# EAGLE design smpsRev8 (EAGLE 9.6.2)
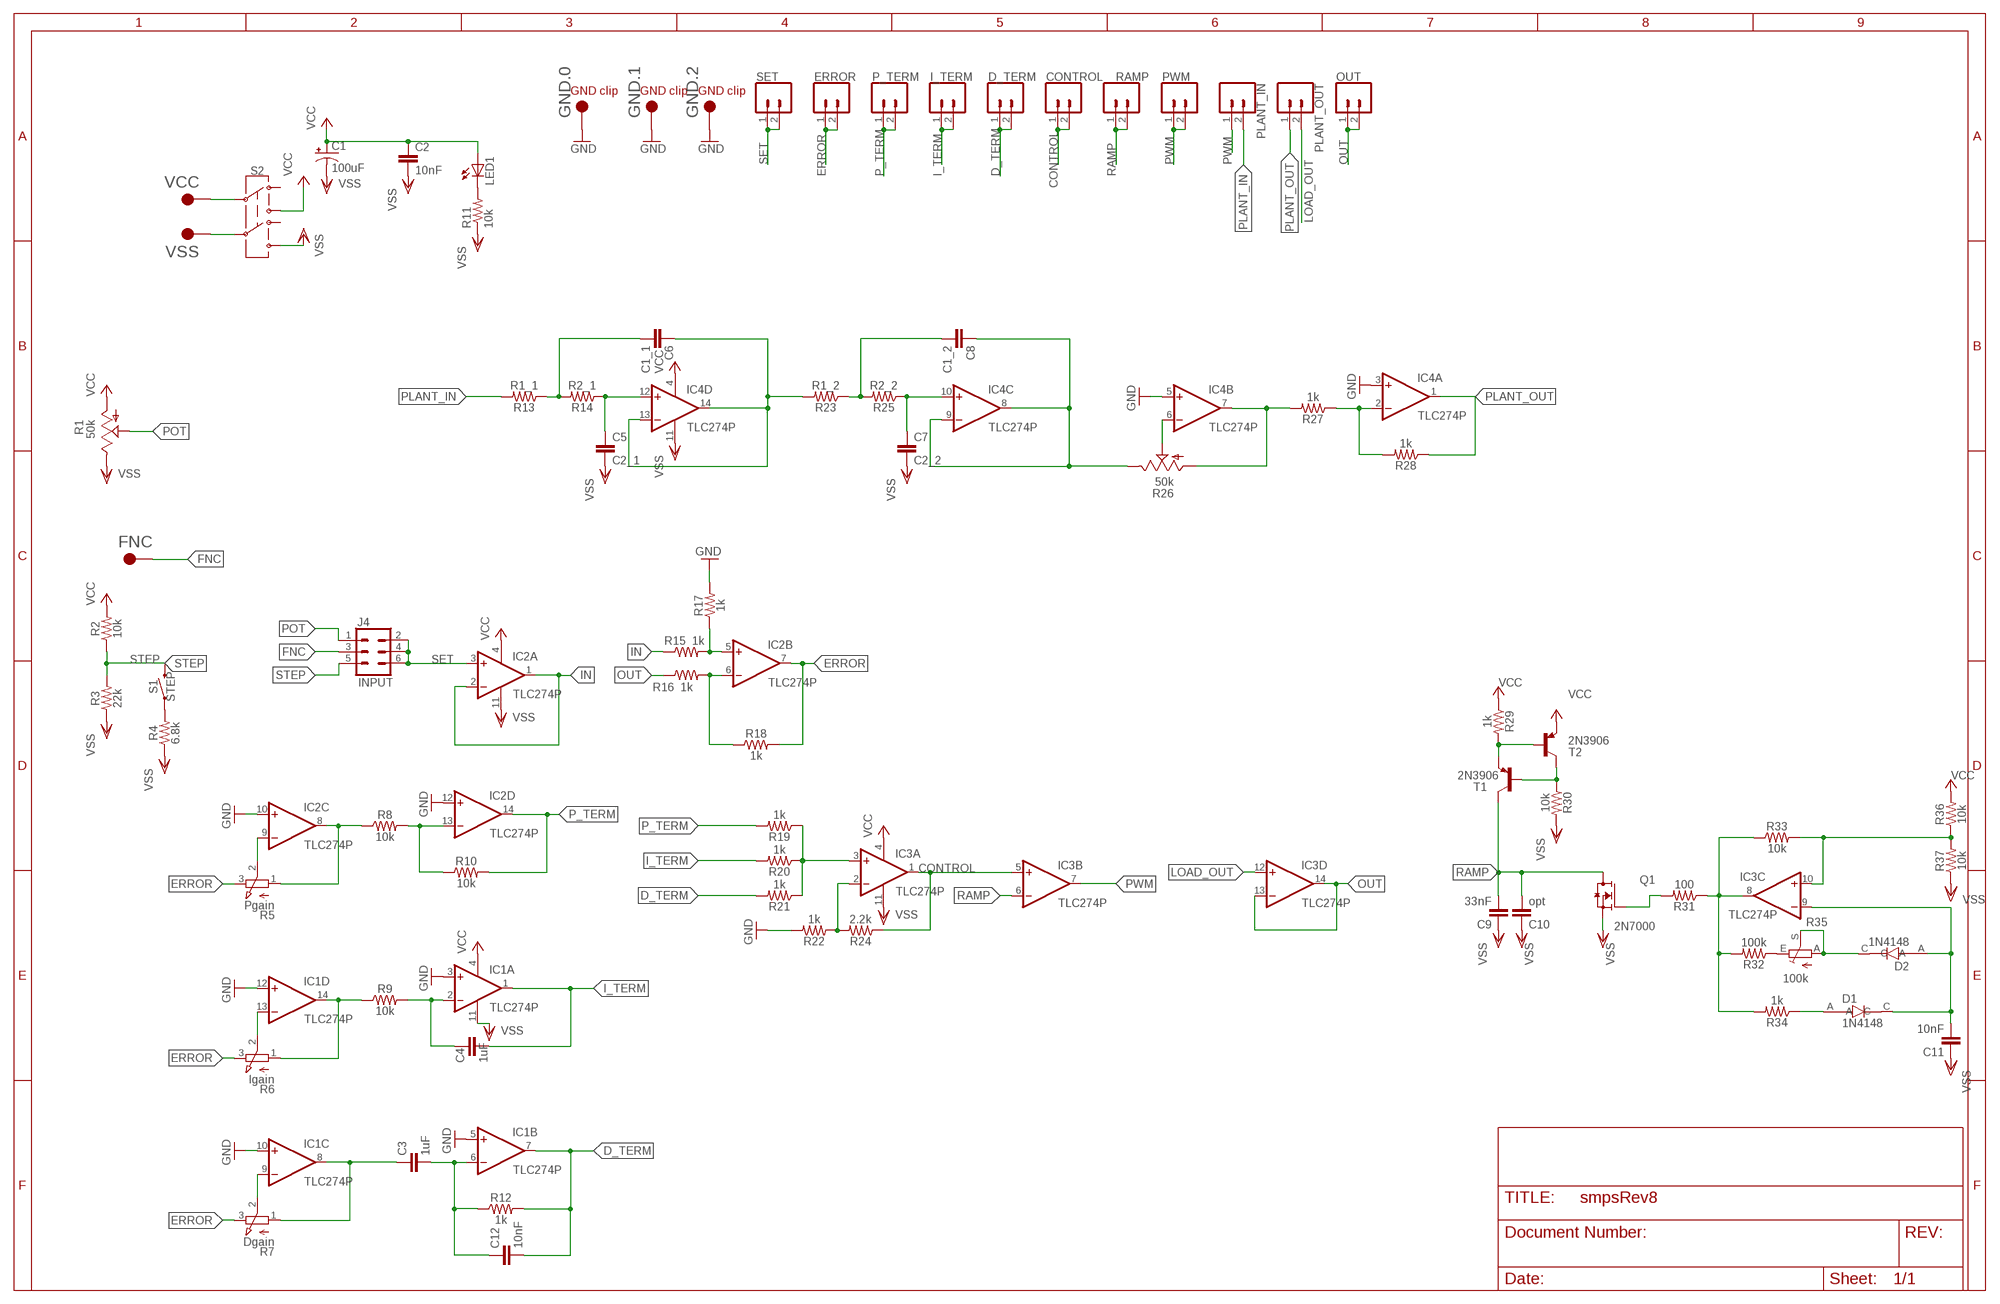
[diagram p0: schematic, sheet 1]

## Parts
C1  100uF  CPOL-USSANYO_C  [SANYO-OSCON_C]
C2  10nF  C-EUC1206  [C1206]
C3  1uF  C-EUC1206  [C1206]
C4  1uF  C-EUC1206  [C1206]
C5  C2_1  C-EUC1206  [C1206]
C6  C1_1  C-EUC1206  [C1206]
C7  C2_2  C-EUC1206  [C1206]
C8  C1_2  C-EUC1206  [C1206]
C9  33nF  C-EUC1206  [C1206]
C10  opt  C-EU050-024X044  [C050-024X044]
C11  10nF  C-EUC1206  [C1206]
C12  10nF  C-EUC1206  [C1206]
CONTROL  CONN_02LOCK  [1X02_LOCK]
D1  1N4148  1N4148WS-7-F  [SOD2513X120N]
D2  1N4148  1N4148WS-7-F  [SOD2513X120N]
D_TERM  CONN_02LOCK  [1X02_LOCK]
ERROR  CONN_02LOCK  [1X02_LOCK]
FNC  5016  [KEYSTONE_5016]
GND.0  5016  [KEYSTONE_5016]
GND.1  5016  [KEYSTONE_5016]
GND.2  5016  [KEYSTONE_5016]
I_TERM  CONN_02LOCK  [1X02_LOCK]
IC1  TLC274P  [DIL14]
IC2  TLC274P  [DIL14]
IC3  TLC274P  [DIL14]
IC4  TLC274P  [DIL14]
J4  INPUT  CONN_03X2FEMALE  [2X3]
LED1  LEDCHIPLED_1206  [CHIPLED_1206]
OUT  CONN_02LOCK  [1X02_LOCK]
P_TERM  CONN_02LOCK  [1X02_LOCK]
PLANT_IN  CONN_02LOCK  [1X02_LOCK]
PLANT_OUT  CONN_02LOCK  [1X02_LOCK]
PWM  CONN_02LOCK  [1X02_LOCK]
Q1  2N7000  [TO92254P458H750-3]
R1  50k  TRIM_US-B25P  [B25P]
R2  10k  RESISTOR1206  [1206]
R3  22k  RESISTOR1206  [1206]
R4  6.8k  RESISTOR1206  [1206]
R5  Pgain  EVUF2A  [EVUF]
R6  Igain  EVUF2A  [EVUF]
R7  Dgain  EVUF2A  [EVUF]
R8  10k  RESISTOR1206  [1206]
R9  10k  RESISTOR1206  [1206]
R10  10k  RESISTOR1206  [1206]
R11  10k  R-US_R1206  [R1206]
R12  1k  RESISTOR1206  [1206]
R13  R1_1  RESISTOR1206  [1206]
R14  R2_1  RESISTOR1206  [1206]
R15  1k  RESISTOR1206  [1206]
R16  1k  RESISTOR1206  [1206]
R17  1k  RESISTOR1206  [1206]
R18  1k  RESISTOR1206  [1206]
R19  1k  RESISTOR1206  [1206]
R20  1k  RESISTOR1206  [1206]
R21  1k  RESISTOR1206  [1206]
R22  1k  RESISTOR1206  [1206]
R23  R1_2  RESISTOR1206  [1206]
R24  2.2k  RESISTOR1206  [1206]
R25  R2_2  RESISTOR1206  [1206]
R26  50k  TRIM_US-B25P  [B25P]
R27  1k  RESISTOR1206  [1206]
R28  1k  RESISTOR1206  [1206]
R29  1k  RESISTOR1206  [1206]
R30  10k  RESISTOR1206  [1206]
R31  100  RESISTOR1206  [1206]
R32  100k  RESISTOR1206  [1206]
R33  10k  RESISTOR1206  [1206]
R34  1k  RESISTOR1206  [1206]
R35  100k  TRIM_EU-S64W  [S64W]
R36  10k  RESISTOR1206  [1206]
R37  10k  RESISTOR1206  [1206]
RAMP  CONN_02LOCK  [1X02_LOCK]
S1  STEP  MOMENTARY-SWITCH-SPST-SMD-5.2MM  [TACTILE_SWITCH_SMD_5.2MM]
S2  SWITCH-DPDT-SMD-AYZ0202  [SWITCH_DPDT_SMD_AYZ0202]
SET  CONN_02LOCK  [1X02_LOCK]
T1  2N3906  2N3906-PNP-TO92-EBC  [TO92-EBC]
T2  2N3906  2N3906-PNP-TO92-EBC  [TO92-EBC]
VCC  5016  [KEYSTONE_5016]
VSS  5016  [KEYSTONE_5016]

## Nets
CONTROL: CONTROL.1 CONTROL.2 IC3.1(A:OUT) IC3.5(B:+IN) R24.1
D_TERM: C12.2 D_TERM.1 D_TERM.2 IC1.7(B:OUT) R12.2 R21.2
ERROR: ERROR.1 ERROR.2 IC2.7(B:OUT) R5.3(E) R6.3(E) R7.3(E) R18.2
FNC: FNC.TP J4.3
GND: GND.0.TP GND.1.TP GND.2.TP IC1.3(A:+IN) IC1.5(B:+IN) IC1.10(C:+IN) IC1.12(D:+IN) IC2.10(C:+IN) IC2.12(D:+IN) IC4.3(A:+IN) IC4.5(B:+IN) R17.2 R22.2
I_TERM: C4.2 I_TERM.1 I_TERM.2 IC1.1(A:OUT) R20.2
IN: IC2.1(A:OUT) IC2.2(A:-IN) R15.1
LOAD_OUT: IC3.12(D:+IN) PLANT_OUT.2
N$1: IC2.5(B:+IN) R15.2 R17.1
N$2: IC2.6(B:-IN) R16.2 R18.1
N$3: IC4.7(B:OUT) R26.A R27.2
N$4: C4.1 IC1.2(A:-IN) R9.2
N$5: IC2.8(C:OUT) R5.1(A) R8.1
N$6: IC3.3(A:+IN) R19.1 R20.1 R21.1
N$7: IC3.2(A:-IN) R22.1 R24.2
N$8: S2.5 VSS.TP
N$9: IC3.10(C:+IN) R33.2 R36.1 R37.2
N$10: IC4.2(A:-IN) R27.1 R28.2
N$11: IC3.8(C:OUT) R31.1 R32.2 R33.1 R34.2
N$12: R29.2 T1.E T2.B
N$13: R30.1 T1.B T2.C
N$14: IC1.14(D:OUT) R6.1(A) R9.1
N$15: S2.2 VCC.TP
N$16: LED1.C R11.2
N$17: C3.1 IC1.8(C:OUT) R7.1(A)
N$18: IC1.13(D:-IN) R6.2(S)
N$19: IC2.13(D:-IN) R8.2 R10.1
N$20: R32.1 R35.E
N$21: IC1.9(C:-IN) R7.2(S)
N$22: C3.2 C12.1 IC1.6(B:-IN) R12.1
N$23: IC2.9(C:-IN) R5.2(S)
N$24: R4.2 S1.1
N$25: C6.2 R13.1 R14.2
N$26: C5.1 IC4.12(D:+IN) R14.1
N$27: C6.1 IC4.13(D:-IN) IC4.14(D:OUT) R23.2
N$28: D1.A R34.1
N$29: C8.2 R23.1 R25.2
N$30: C7.1 IC4.10(C:+IN) R25.1
N$31: C8.1 IC4.8(C:OUT) IC4.9(C:-IN) R26.E
N$32: C11.2 D1.C D2.A IC3.9(C:-IN)
N$33: IC4.6(B:-IN) R26.S
N$34: Q1.2(G) R31.2
N$35: D2.C R35.A R35.S
OUT: IC3.13(D:-IN) IC3.14(D:OUT) OUT.1 OUT.2 R16.1
P_TERM: IC2.14(D:OUT) P_TERM.1 P_TERM.2 R10.2 R19.2
PLANT_IN: PLANT_IN.2 R13.2
PLANT_OUT: IC4.1(A:OUT) PLANT_OUT.1 R28.1
POT: J4.1 R1.S
PWM: IC3.7(B:OUT) PLANT_IN.1 PWM.1 PWM.2
RAMP: C9.2 C10.2 IC3.6(B:-IN) Q1.3(D) RAMP.1 RAMP.2 T1.C
SET: IC2.3(A:+IN) J4.2 J4.4 J4.6 SET.1 SET.2
STEP: J4.5 R2.1 R3.2 S1.3
VCC: C1.+ C2.1 IC1.4(P:V+) IC2.4(P:V+) IC3.4(P:V+) IC4.4(P:V+) LED1.A R1.A R2.2 R29.1 R36.2 S2.3 T2.E
VSS: C1.- C2.2 C5.2 C7.2 C9.1 C10.1 C11.1 IC1.11(P:V-) IC2.11(P:V-) IC3.11(P:V-) IC4.11(P:V-) Q1.1(S) R1.E R3.1 R4.1 R11.1 R30.2 R37.1 S2.6
Unconnected: S2.1 S2.4

## Notes on the sheet
- GND clip | GND clip | GND clip

## Library data of the parts
C1 = rcl:CPOL-US: POLARIZED CAPACITOR, American symbol; SPICEPREFIX: C
C2-C12 = rcl:C-EU: CAPACITOR, European symbol; SPICEPREFIX: C
CONTROL D_TERM ERROR I_TERM OUT P_TERM PLANT_IN PLANT_OUT PWM RAMP SET = SparkFun-Connectors:CONN_02: Multi connection point. Often used as Generic Header-pin footprint for 0.1 inch spaced/style header connections On any of the 0.1 inch spaced packages, you can populate with these: Break Away Headers - Straight <https://www.sparkfun.com/products/116> (PRT-00116) Break Away Male Headers - Right Angle <https://www.sparkfun.com/products/553> (PRT-00553) Female Headers <https://www.sparkfun.com/products/115> (PRT-00115) Break Away Headers - Machine Pin <https://www.sparkfun.com/products/117> (PRT-00117) Break Away Female Headers - Swiss Machine Pin <https://www.sparkfun.com/products/743> (PRT-00743) For SCREWTERMINALS and SPRING TERMINALS visit here: Screw Terimnals on SparkFun.com <https://www.sparkfun.com/search/results?term=Screw+Terminals> (5mm/3.5mm/2.54mm spacing) This device is also useful as a general connection point to wire up your design to another part of your project. Our various solder wires solder well into these plated through hole pads. Hook-Up Wire - Assortment (Stranded, 22 AWG) <https://www.sparkfun.com/products/11375> (PRT-11375) Hook-Up Wire - Assortment (Solid Core, 22 AWG) <https://www.sparkfun.com/products/11367> (PRT-11367) View the entire wire category on our website here <https://www.sparkfun.com/categories/141> Special notes: Molex polarized connector foot print use with: PRT-08233 with associated crimp pins and housings. 2.54_SCREWTERM for use with PRT-10571. 3.5mm Screw Terminal footprints for PRT-08084 5mm Screw Terminal footprints for use with PRT-08432
D1 D2 = 1N4148WS-7-F:1N4148WS-7-F; MANUFACTURER: Diodes Inc.
FNC GND.0 GND.1 GND.2 VCC VSS = 5016:5016; MANUFACTURER: Keystone Electronics; MAXIMUM_PACKAGE_HEIGHT: 2.29 mm; PARTREV: D; SNAPEDA_PN: 5016; STANDARD: Manufacturer Recommendations
IC1-IC4 = linear:TLC274: OP AMP
J4 = SparkFun-Connectors:CONN_03X2: Multi connection point. Often used as Generic Header-pin footprint for 0.1 inch spaced/style header connections You can populate with any combo of single row headers, but if you'd like an exact match, check these: Header - 2x3 (Male, 0.1") <https://www.sparkfun.com/products/12807> (PRT-12807) Header - 2x3 (Female, 0.1") <https://www.sparkfun.com/products/13010> (PRT-13010) 2x3 Pin Shrouded Header <https://www.sparkfun.com/products/10877> (PRT-10877) On any of the 0.1 inch spaced packages, you can populate with these: Break Away Headers - Straight <https://www.sparkfun.com/products/116> (PRT-00116) Break Away Male Headers - Right Angle <https://www.sparkfun.com/products/553> (PRT-00553) Female Headers <https://www.sparkfun.com/products/115> (PRT-00115) Break Away Headers - Machine Pin <https://www.sparkfun.com/products/117> (PRT-00117) Break Away Female Headers - Swiss Machine Pin <https://www.sparkfun.com/products/743> (PRT-00743) Special note: the shrouded connector mates well with our 3x2 ribbon cables: Ribbon Crimp Connector - 6-pin (2x3, Female) <https://www.sparkfun.com/products/10651> (PRT-10651) Ribbon Cable - 6 wire (15ft) <https://www.sparkfun.com/products/10646> (PRT-10646); PROD_ID: CONN-11566; VALUE: FEMALE 2x3
LED1 = led:LED: LED OSRAM: - CHIPLED LG R971, LG N971, LY N971, LG Q971, LY Q971, LO R971, LY R971 LH N974, LH R974 LS Q976, LO Q976, LY Q976 LO Q996 - Hyper CHIPLED LW Q18S LB Q993, LB Q99A, LB R99A - SideLED LS A670, LO A670, LY A670, LG A670, LP A670 LB A673, LV A673, LT A673, LW A673 LH A674 LY A675 LS A676, LA A676, LO A676, LY A676, LW A676 LS A679, LY A679, LG A679 - Hyper Micro SIDELED® LS Y876, LA Y876, LO Y876, LY Y876 LT Y87S - SmartLED LW L88C, LW L88S LB L89C, LB L89S, LG L890 LS L89K, LO L89K, LY L89K LS L896, LA L896, LO L896, LY L896 - TOPLED LS T670, LO T670, LY T670, LG T670, LP T670 LSG T670, LSP T670, LSY T670, LOP T670, LYG T670 LG T671, LOG T671, LSG T671 LB T673, LV T673, LT T673, LW T673 LH T674 LS T676, LA T676, LO T676, LY T676, LB T676, LH T676, LSB T676, LW T676 LB T67C, LV T67C, LT T67C, LS T67K, LO T67K, LY T67K, LW E67C LS E67B, LA E67B, LO E67B, LY E67B, LB E67C, LV E67C, LT E67C LW T67C LS T679, LY T679, LG T679 LS T770, LO T770, LY T770, LG T770, LP T770 LB T773, LV T773, LT T773, LW T773 LH T774 LS E675, LA E675, LY E675, LS T675 LS T776, LA T776, LO T776, LY T776, LB T776 LHGB T686 LT T68C, LB T68C - Hyper Mini TOPLED® LB M676 - Mini TOPLED Santana® LG M470 LS M47K, LO M47K, LY M47K Source: http://www.osram.convergy.de LUXEON: - LUMILED® LXK2-PW12-R00, LXK2-PW12-S00, LXK2-PW14-U00, LXK2-PW14-V00 LXK2-PM12-R00, LXK2-PM12-S00, LXK2-PM14-U00 LXK2-PE12-Q00, LXK2-PE12-R00, LXK2-PE12-S00, LXK2-PE14-T00, LXK2-PE14-U00 LXK2-PB12-K00, LXK2-PB12-L00, LXK2-PB12-M00, LXK2-PB14-N00, LXK2-PB14-P00, LXK2-PB14-Q00 LXK2-PR12-L00, LXK2-PR12-M00, LXK2-PR14-Q00, LXK2-PR14-R00 LXK2-PD12-Q00, LXK2-PD12-R00, LXK2-PD12-S00 LXK2-PH12-R00, LXK2-PH12-S00 LXK2-PL12-P00, LXK2-PL12-Q00, LXK2-PL12-R00 Source: www.luxeon.com KINGBRIGHT: KA-3528ASYC Source: www.kingbright.com
Q1 = 2N7000:2N7000; MANUFACTURER: Diotec Semiconductor; MAXIMUM_PACKAGE_HEIGHT: 7.5mm; PARTREV: 2024-07-16; STANDARD: IPC 7351B
R1 R26 = pot:TRIM_US-: POTENTIOMETER
R2-R4 R8-R10 R12-R25 R27-R34 R36 R37 = SparkFun-Resistors:RESISTOR: Generic Resistor Package
R5-R7 = pot:EVU: 9 mm Square Rotary Potentiometers Source: Panasonic
R11 = rcl:R-US_: RESISTOR, American symbol; SPICEPREFIX: R
R35 = pot:TRIM_EU-: POTENTIOMETER
S1 = SparkFun-Switches:MOMENTARY-SWITCH-SPST: Momentary Switch (Pushbutton) - SPST Normally-open (NO) SPST momentary switches (buttons, pushbuttons). Variants PTH-12MM - 12mm square, through-hole Momentary Pushbutton Switch - 12mm Square <https://www.sparkfun.com/products/9190> (COM-09190) PTH-6.0MM, PTH-6.0MM-KIT - 6.0mm square, through-hole Mini Pushbutton Switch <https://www.sparkfun.com/products/97> (COM-00097) KIT package intended for soldering kit's - only one side of pads' copper is exposed. PTH-RIGHT-ANGLE-KIT - Right-angle, through-hole Right Angle Tactile Button <https://www.sparkfun.com/products/10791> - Used on SparkFun BigTime Watch Kit <https://www.sparkfun.com/products/11734> SMD-12MM - 12mm square, surface-mount Tactile Button - SMD (12mm) <https://www.sparkfun.com/products/12993> (COM-12993) Used on SparkFun PicoBoard <https://www.sparkfun.com/products/11888> SMD-4.5MM - 4.5mm Square Trackball Switch Used on SparkFun Blackberry Trackballer Breakout <https://www.sparkfun.com/products/13169> SMD-4.6MMX2.8MM - 4.60mm x 2.80mm, surface mount Used on SparkFun SAMD21 Mini Breakout <https://www.sparkfun.com/products/13664> SMD-5.2MM, SMD-5.2-REDUNDANT - 5.2mm square, surface-mount Mini Pushbutton Switch - SMD <https://www.sparkfun.com/products/8720> (COM-08720) Used on Arduino Pro Mini <https://www.sparkfun.com/products/11114> REDUNDANT package connects both switch circuits together SMD-6.0X3.5MM - 6.0 x 3.5mm, surface mount Momentary Reset Switch SMD <https://www.sparkfun.com/products/8229> (COM-08229) SMD-6.2MM-TALL - 6.2mm square, surface mount Tactile Button - SMD (6mm) <https://www.sparkfun.com/products/12992> Used on SparkFun Digital Sandbox <https://www.sparkfun.com/products/12651> SMD-RIGHT-ANGLE - Right-angle, surface mount Used on SparkFun Block for Intel® Edison - Arduino <https://www.sparkfun.com/products/13036>; PROD_ID: SWCH-08247; SF_SKU: COM-08720
S2 = SparkFun-Switches:SWITCH-DPDT: Double-Pole, Double-Throw (DPDT) Switch Double-pole, double-throw switches. Variant Overview PTH-GPI-152-3013 Used on SparkFun Geiger Counter <https://www.sparkfun.com/products/11345> SMD-AY0202 Surface Mount DPDT Switch <https://www.sparkfun.com/products/597> (COM-00597) Used on e.g. LilyPad Arduino USB - ATmega32U4 Board <https://www.sparkfun.com/products/12049>; PROD_ID: SWCH-08179; SF_SKU: COM-00597
T1 T2 = transistor-neu-to92:*-PNP-: PNP Transistror

## Board
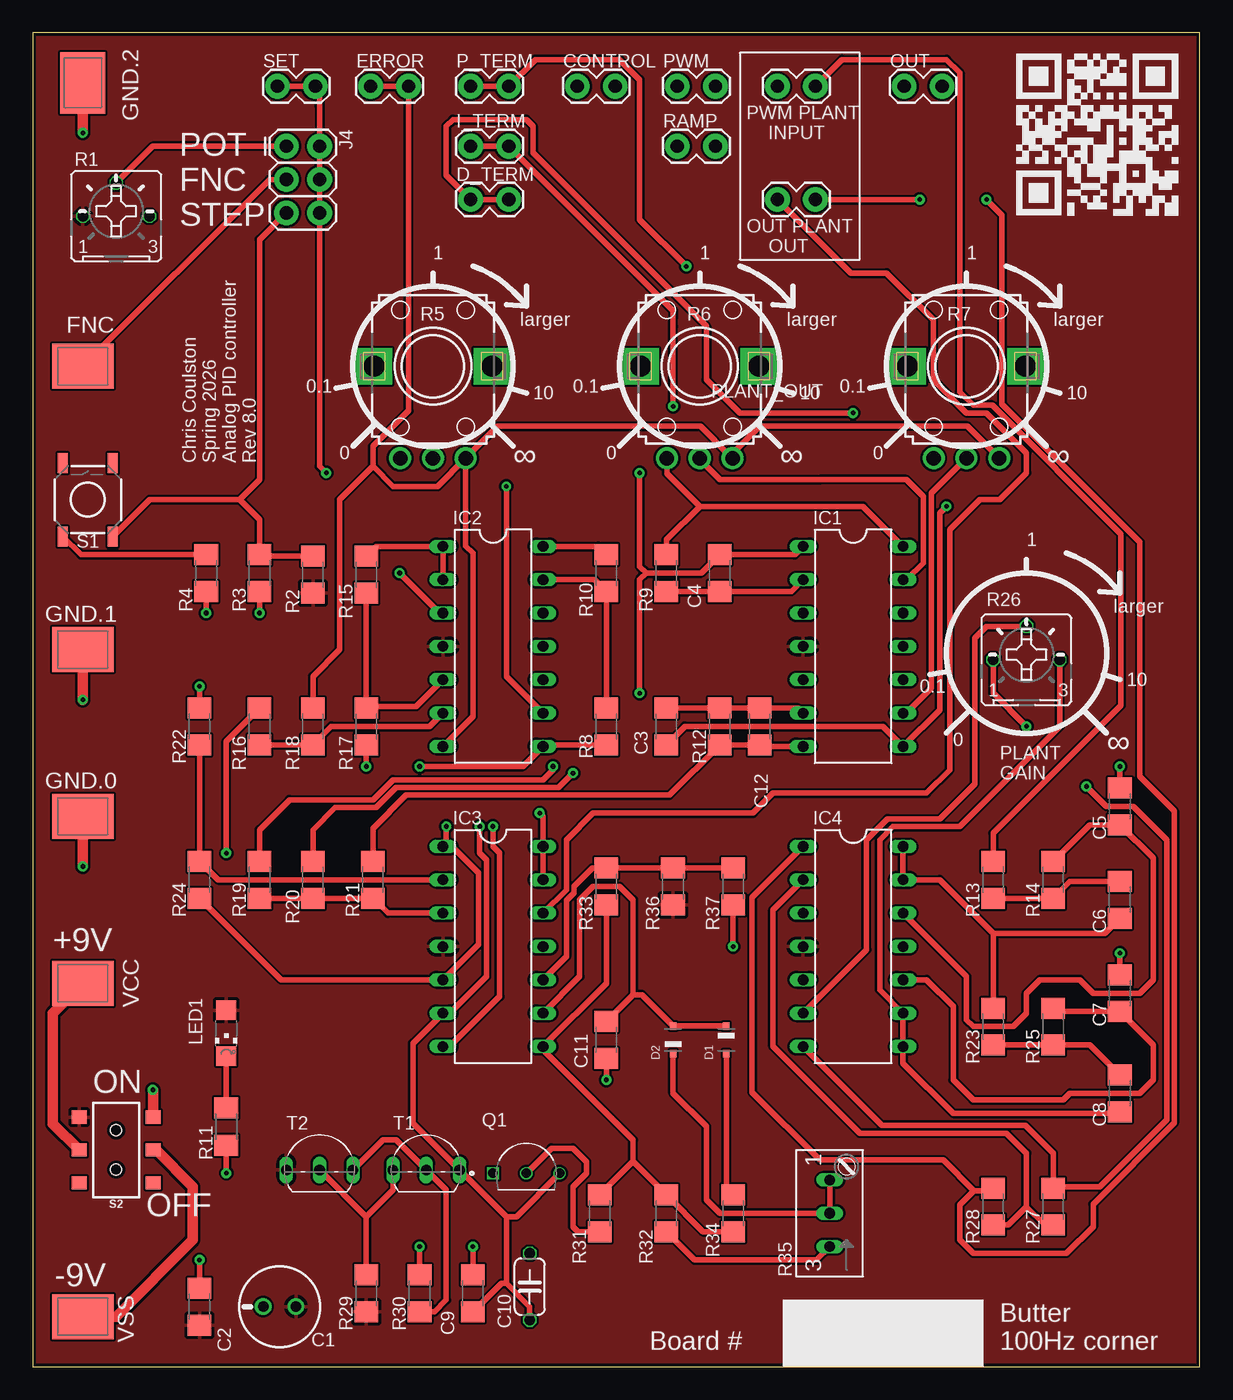
[diagram p1: board, top side]
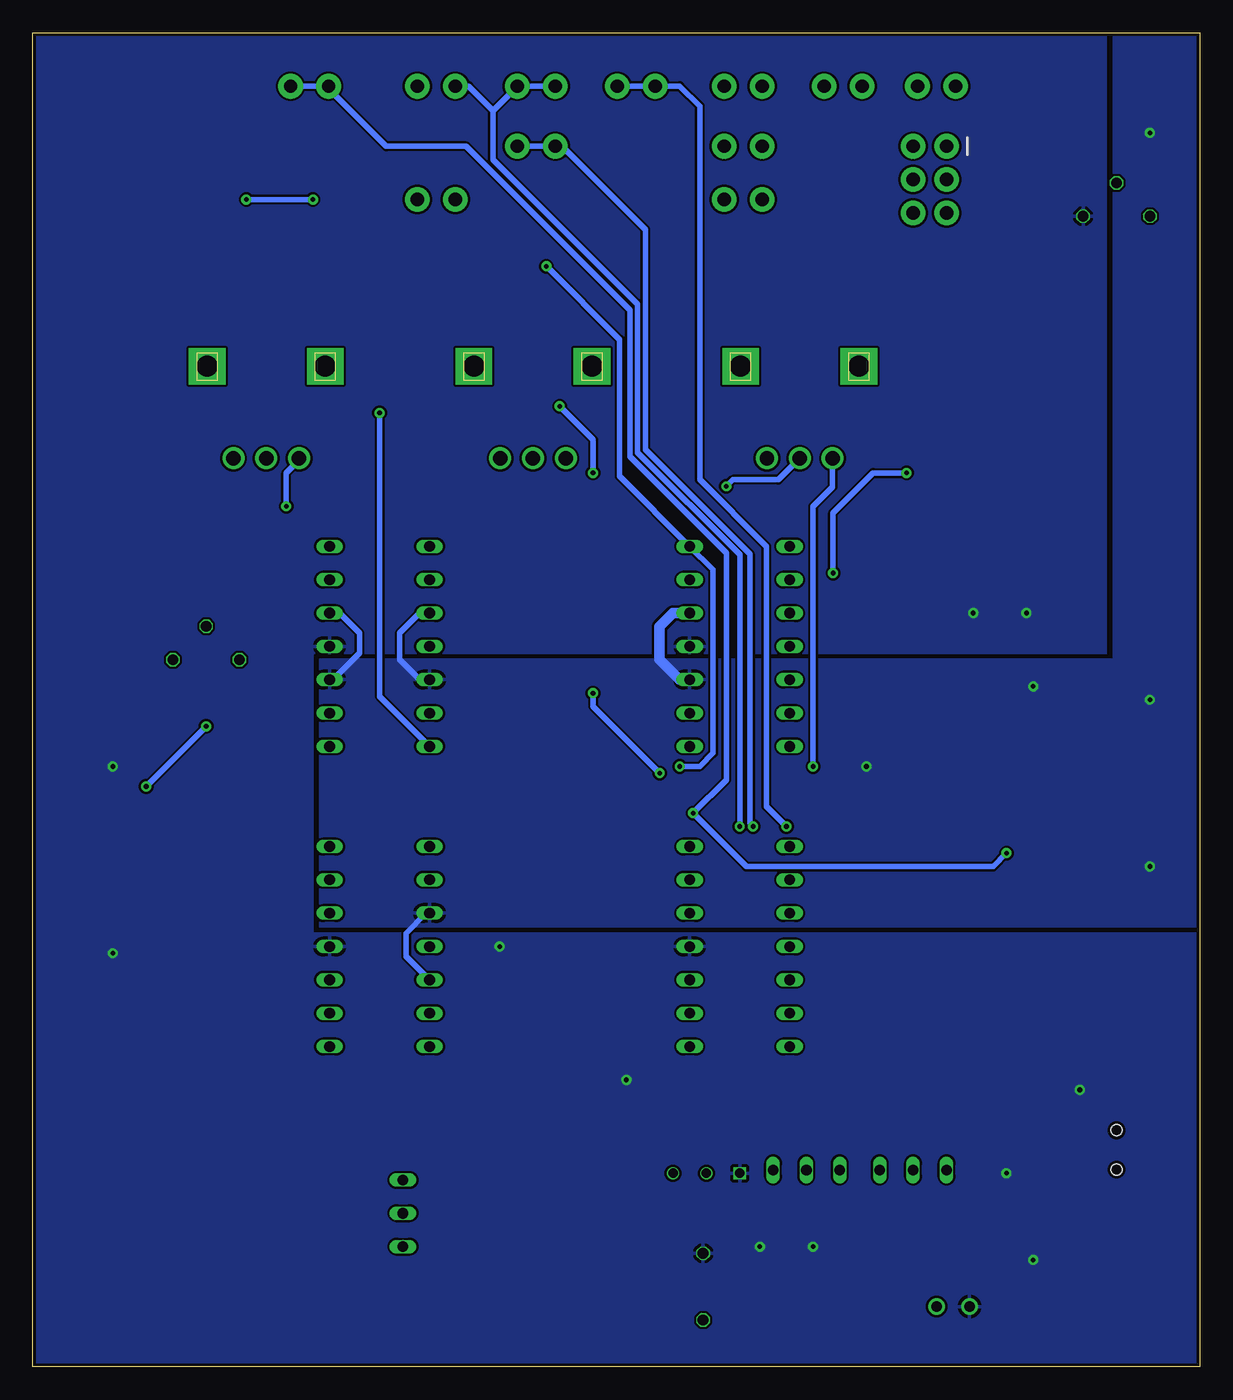
[diagram p2: board, bottom side, seen from below]

Size 88.9 x 101.6 mm. Coordinates in mm from the lower left corner, seen from the top.
Outline: 0,0 88.9,0 88.9,101.6 0,101.6 0,0
Copper layers (1*16): Top 0.0356mm / dielectric 1.5011mm / Bottom 0.0356mm
Design rules "SilverCircuits *": minimum track width 7mil, minimum drill 10mil, track to track 7mil, track to pad 7mil, pad to pad 7mil, via to via 7mil, smd to smd 0mil, copper to edge 10mil, drill to drill 10mil, minimum pad ring 4mil, minimum via ring 8mil, stop-mask expansion 4mil, vias tented up to drill 0mil, thermal gap 10mil

### Footprints (pad centres in the part's own frame; a part is rotated, then mirrored left to right if it is on the bottom)
SANYO-OSCON_C = drill 0.8 pad 1.27: + 1.25,0; - -1.25,0
C1206 = smd 1.6 x 1.8: 1 -1.4,0; 2 1.4,0
C050-024X044 = drill 0.813 octagon: 1 -2.54,0; 2 2.54,0
1X02_LOCK = drill 1.016 pad 1.88: 1 -0.178,0; 2 2.718,0
SOD2513X120N = smd 0.6 x 0.5: A 1.05,0; C -1.05,0
KEYSTONE_5016 = smd 4.7 x 3.43: TP 0,0
DIL14 = drill 0.813 long: 1 -7.62,-3.81; 2 -5.08,-3.81; 3 -2.54,-3.81; 4 0,-3.81; 5 2.54,-3.81; 6 5.08,-3.81; 7 7.62,-3.81; 8 7.62,3.81; 9 5.08,3.81; 10 2.54,3.81; 11 0,3.81; 12 -2.54,3.81; 13 -5.08,3.81; 14 -7.62,3.81
2X3 = drill 1.016 pad 1.88: 1 0,0; 2 0,2.54; 3 2.54,0; 4 2.54,2.54; 5 5.08,0; 6 5.08,2.54
CHIPLED_1206 = smd 1.5 x 1.5: A 0,-1.75; C 0,1.75
TO92254P458H750-3 = drill 0.72 square: 1 -2.54,0 | drill 0.72: 2 0,0; 3 2.54,0
B25P = drill 0.813 octagon: A -2.54,0; E 2.54,0; S 0,2.54
1206 = smd 1.6 x 1.8: 1 -1.4,0; 2 1.4,0
EVUF = drill 1.1 pad 1.676: 1 -2.5,-7; 2 0,-7; 3 2.5,-7 | drill 1.6 pad 2.8 square: M1 4.5,0; M2 -4.5,0
R1206 = smd 1.6 x 1.803: 1 -1.422,0; 2 1.422,0
S64W = drill 0.813 long: A 2.54,1.27; E -2.54,1.27; S 0,1.27
TACTILE_SWITCH_SMD_5.2MM = smd 1.524 x 0.762: 1 -2.794,1.905; 2 2.794,1.905; 3 -2.794,-1.905; 4 2.794,-1.905
SWITCH_DPDT_SMD_AYZ0202 = smd 1 x 1.15: 1 -2.5,2.825; 2 0,2.825; 3 2.5,2.825; 4 -2.5,-2.825; 5 0,-2.825; 6 2.5,-2.825 | hole 0.85: 1.5,0; -1.5,0
TO92-EBC = drill 0.813 long: B 0,-1.27; C 2.54,-1.27; E -2.54,-1.27

### Placement (x,y rotation side)
C1  18.8,4.57 0 top
C2  12.7,4.57 90 top
C3  48.26,48.77 90 top
C4  52.32,60.45 90 top
C5  82.8,42.67 90 top
C6  82.8,35.56 90 top
C7  82.8,28.45 90 top
C8  82.8,20.83 90 top
C9  33.53,5.59 270 top
C10  37.85,6.1 270 top
C11  43.69,24.89 90 top
C12  55.37,48.77 270 top
CONTROL  41.66,97.54 0 top
D1  52.83,24.89 270 top
D2  48.77,24.89 90 top
D_TERM  33.53,88.9 0 top
ERROR  25.91,97.54 0 top
FNC  3.81,76.2 0 top
GND.0  3.81,41.91 180 top
GND.1  3.81,54.61 180 top
GND.2  3.81,97.79 270 top
I_TERM  33.53,92.96 0 top
IC1  62.48,54.86 270 top
IC2  35.05,54.86 270 top
IC3  35.05,32 270 top
IC4  62.48,32 270 top
J4  19.3,92.96 270 top
LED1  14.73,25.4 180 top
OUT  66.55,97.54 0 top
P_TERM  33.53,97.54 0 top
PLANT_IN  56.9,97.54 0 top
PLANT_OUT  59.44,88.9 180 top
PWM  49.28,97.54 0 top
Q1  37.59,14.73 0 top
R1  6.35,87.63 0 top
R2  21.34,60.33 270 top
R3  17.27,60.45 90 top
R4  13.21,60.45 90 top
R5  30.48,76.2 0 top
R6  50.8,76.2 0 top
R7  71.12,76.2 0 top
R8  43.69,48.77 90 top
R9  48.26,60.45 270 top
R10  43.69,60.45 90 top
R11  14.73,18.29 90 top
R12  52.32,48.77 270 top
R13  73.15,37.08 90 top
R14  77.72,37.08 270 top
R15  25.4,60.33 270 top
R16  17.27,48.77 270 top
R17  25.4,48.77 270 top
R18  21.34,48.77 90 top
R19  17.27,37.08 90 top
R20  21.34,37.08 90 top
R21  25.91,37.08 90 top
R22  12.7,48.77 90 top
R23  73.15,25.91 90 top
R24  12.7,37.08 90 top
R25  77.72,25.91 270 top
R26  75.69,53.85 0 top
R27  77.72,12.19 90 top
R28  73.15,12.19 270 top
R29  25.4,5.59 90 top
R30  29.46,5.59 90 top
R31  43.18,11.68 270 top
R32  48.26,11.68 90 top
R33  43.69,36.58 90 top
R34  53.34,11.68 270 top
R35  61.98,11.68 90 top
R36  48.77,36.58 270 top
R37  53.34,36.58 90 top
RAMP  49.28,92.96 0 top
S1  4.19,66.04 90 top
S2  6.35,16.51 90 top
SET  18.8,97.54 0 top
T1  29.97,16.26 0 top
T2  21.84,16.26 0 top
VCC  3.81,29.21 180 top
VSS  3.81,3.81 180 top

### Tracks (layer width: path | path; a pad name or v marks a point on that pad's centre or on a via)
CONTROL  (via drill 0.35)
  Top 0.406: v31.5,41.15 31.5,39.88 IC3.1 31.93,39.62 33.96,37.59 33.96,32.18 IC3.5 18.92,29.46 R24.1
  Bottom 0.406: v31.5,41.15 33.02,42.67 33.02,62.48 38.1,67.56 38.1,96.01 39.62,97.54 CONTROL.1 CONTROL.2
D_TERM  (via drill 0.35)
  Top 0.406: v62.48,72.64 53.85,72.64 51.31,75.18 51.31,79.25 38.1,92.46 38.1,94.49 37.59,95 32,95 31.5,94.49 31.5,90.75 D_TERM.1 D_TERM.2 | R21.2 25.91,41 28.45,43.54 48.49,43.54 R12.2 C12.2 55.5,47.24 IC1.7
  Bottom 0.406: v62.48,72.64 62.48,51.05 IC1.7
ERROR
  Top 0.406: IC2.7 33.53,49.53 33.53,61.98 32.98,62.52 R5.3 | R5.3 30.84,67.06 27.43,67.06 25.91,68.58 | 25.91,68.58 25.91,70.1 28.63,72.82 ERROR.2 ERROR.1 | 25.91,68.58 23.37,66.04 23.37,54.61 21.34,52.58 R18.2 | R5.3 35.41,71.63 50.87,71.63 53.12,69.38 | 53.12,69.38 R6.3 | R7.3 71.19,71.63 55.37,71.63 53.12,69.38
FNC
  Top 0.406: FNC.TP 18.03,90.42 J4.3
GND  (via drill 0.35)
  Top 0.406: R17.2 v25.4,45.72 | R22.2 v12.7,51.82
  Top 0.813: GND.0.TP v3.81,38.1 | GND.1.TP v3.81,50.8 | GND.2.TP v3.81,93.98
  Bottom 0.406: IC1.5 59.44,52.32 60.96,53.85 60.96,55.88 59.44,57.4 IC1.3 | IC1.12 65.53,57.4 64.01,55.88 64.01,54.36 66.04,52.32 IC1.10 | IC4.3 58.93,34.54 60.45,33.02 60.45,31.24 IC4.5
  Bottom 0.813: IC2.10 39.62,52.32 41.15,53.85 41.15,56.39 40.13,57.4 IC2.12
  pour Bottom: 0,33.53 0,101.6 6.6,101.6 6.6,53.85 67.06,53.85 67.06,33.53
I_TERM  (via drill 0.35)
  Top 0.406: v48.77,73.15 48.77,79.25 48.77,79.93 48.77,80.44 I_TERM.2 I_TERM.1 | v46.23,51.31 46.23,59.94 46.74,60.45 | v41.15,45.21 40.06,44.12 27.67,44.12 26.15,42.6 23.04,42.6 21.34,40.89 R20.2 | IC1.1 58.04,61.85 C4.2 50.92,60.45 46.74,60.45 | 46.74,60.45 46.23,60.96 v46.23,68.07
  Bottom 0.406: v46.23,68.07 46.23,70.61 v48.77,73.15 | v46.23,51.31 46.23,50.29 v41.15,45.21
IN
  Top 0.406: IC2.2 IC2.1 26.16,62.48 R15.1
LOAD_OUT
  Top 0.406: IC3.12 40.64,36.32 40.64,40.13 42.67,42.16 54.86,42.16 56.39,43.69 68.07,43.69 69.85,45.47 69.85,63.75 72.14,66.04 73.66,66.04 75.69,68.07 75.69,69.6 72.64,72.64 71.12,72.64 68.58,75.18 68.58,79.76 65.02,83.31 62.31,83.31 PLANT_OUT.2
N$1
  Top 0.406: R15.2 25.4,50.29 | 25.4,50.29 R17.1 | IC2.5 29.21,50.29 25.4,50.29
N$2
  Top 0.406: IC2.6 30.23,48.77 22.74,48.77 R18.1 R16.2
N$3  (via drill 0.35)
  Top 0.406: IC4.7 64.69,18.36 75.62,18.36 77.72,16.26 77.72,13.72 | v80.26,44.2 81.79,42.67 83.82,42.67 86.36,40.13 86.36,18.8 81.28,13.72 77.72,13.72 | v75.69,48.77 73.15,51.31 R26.A | R27.2 77.72,13.72
  Bottom 0.406: v80.26,44.2 v75.69,48.77
N$4
  Top 0.406: R9.2 C4.1 57.78,59.05 IC1.2
N$5  (via drill 0.35)
  Top 0.406: v29.46,45.72 37.34,45.72 IC2.8 38.99,47.37 R8.1
  Bottom 0.406: R5.1 27.98,67.02 29.46,65.53 v29.46,45.72
N$6
  Top 0.406: R19.1 R20.1 R21.1 27.05,34.54 IC3.3
N$7
  Top 0.406: IC3.2 16.76,37.08 16.26,37.08 14.1,37.08 R24.2 R22.1
N$8
  Top 0.813: S2.5 9.4,16.51 12.19,13.72 12.19,9.65 6.35,3.81 VSS.TP
N$9
  Top 0.406: IC3.10 40.64,31.24 40.64,35.5 41.22,36.08 41.22,36.58 42.62,37.98 R33.2 R36.1 R37.2
N$10
  Top 0.406: IC4.2 56.39,34.8 56.39,24.38 62.99,17.78 74.17,17.78 75.69,16.26 75.69,12.19 | R27.1 77.09,10.79 75.69,12.19 | R28.2 74.29,10.79 75.69,12.19
N$11
  Top 0.406: R31.1 45.72,15.62 | 45.72,15.62 45.72,17.27 38.86,24.13 IC3.8 43.69,29.21 R33.1 | 45.72,15.62 R32.2 51.06,10.28 R34.2
N$12
  Top 0.406: T2.B 25.4,11.43 | 25.4,11.43 R29.2 | T1.E 27.43,13.46 25.4,11.43
N$13
  Top 0.406: T2.C 26.67,17.27 27.69,17.27 T1.B 31.5,13.46 31.5,5.08 30.6,4.19 R30.1
N$14
  Top 0.406: 50.8,65.53 63.25,65.53 IC1.14 | 50.8,65.53 48.26,62.99 R9.1 | R6.1 48.3,68.03 50.8,65.53
N$15
  Top 0.813: S2.2 1.52,18.51 1.52,26.92 VCC.TP
N$16
  Top 0.406: LED1.C R11.2
N$17  (via drill 0.35)
  Top 0.406: v69.6,65.53 69.09,65.02 69.09,50.04 IC1.8 64.77,48.77 49.66,48.77 C3.1
  Bottom 0.406: R7.1 68.54,69.12 69.6,68.07 v69.6,65.53
N$18
  Top 0.406: IC1.13 66.55,59.94 67.82,61.21 67.82,66.29 66.55,67.56 59.94,67.56 59.44,67.56 52.32,67.56 50.8,69.09 R6.2
N$19
  Top 0.406: R8.2 R10.1 42.8,59.94 IC2.13
N$20
  Top 0.406: R32.1 50.42,8.13 59.69,8.13 R35.E
N$21
  Top 0.406: IC1.9 66.55,49.78 68.45,51.69 68.45,66.53 R7.2
N$22
  Top 0.406: C3.2 R12.1 C12.1 58.29,50.17 IC1.6
N$23  (via drill 0.35)
  Top 0.406: IC2.9 36.07,52.58 v36.07,67.06
  Bottom 0.406: R5.2 32.12,67.56 35.56,67.56 v36.07,67.06
N$24
  Top 0.406: S1.1 3.68,61.85 R4.2
N$25
  Top 0.406: C6.2 79,36.96 R14.2 R13.1
N$26
  Top 0.406: R14.1 80.51,41.27 C5.1 85.34,38.73 85.34,29.46 84.33,28.45 80.77,28.45 79.76,29.46 76.71,29.46 75.69,28.45 75.69,26.92 74.68,25.91 71.63,25.91 71.12,26.42 71.12,29.72 IC4.12
N$27
  Top 0.406: IC4.14 IC4.13 69.09,37.08 73.15,33.02 | 73.15,33.02 R23.2 | C6.1 81.66,33.02 73.15,33.02
N$28
  Top 0.406: R34.1 52.83,13.59 D1.A
N$29
  Top 0.406: R23.1 R25.2 80.52,24.51 C8.2
N$30
  Top 0.406: IC4.10 68.07,29.46 70.1,27.43 70.1,21.84 71.63,20.32 78.49,20.32 78.99,20.83 84.33,20.83 85.34,21.84 85.34,24.51 C7.1 77.98,27.05 R25.1
N$31
  Top 0.406: R26.E 78.23,48.77 70.61,41.15 65.53,41.15 64.52,40.13 64.52,28.7 IC4.9 IC4.8 66.29,23.11 70.1,19.3 82.68,19.3 C8.1
N$32
  Top 0.406: IC3.9 41.66,29.72 41.66,35.56 42.67,36.58 44.7,36.58 45.72,35.56 45.72,28.32 | C11.2 45.72,28.32 | 45.72,28.32 46.39,28.32 D2.A D1.C
N$33
  Top 0.406: IC4.6 63.5,31.75 63.5,40.13 65.1,41.73 69.09,41.73 71.75,44.4 71.75,55.5 72.64,56.39 R26.S
N$34
  Top 0.406: Q1.2 39.5,16.64 41.15,16.64 42.16,15.62 42.16,14.73 41.15,13.72 41.15,10.67 41.53,10.28 R31.2
N$35
  Top 0.406: R35.A R35.S 52.32,11.68 51.31,12.7 51.31,18.29 48.77,20.83 D2.C
OUT  (via drill 0.35)
  Top 0.406: v38.61,42.16 38.86,41.91 IC3.14 IC3.13 | v14.73,39.12 14.73,47.63 R16.1
  Bottom 0.406: v14.73,39.12 15.75,38.1 34.54,38.1 v38.61,42.16 36.07,44.7 36.07,61.98 43.41,69.32 43.41,80.49 55.88,92.96 61.98,92.96 66.37,97.36 OUT.1 OUT.2
P_TERM  (via drill 0.35)
  Top 0.406: v39.62,45.72 39.62,45.47 38.86,44.7 27.43,44.7 25.91,43.18 19.56,43.18 17.27,40.89 R19.2 | v49.78,83.82 46.23,87.38 46.23,98.04 44.7,99.57 38.28,99.57 P_TERM.2 P_TERM.1 | IC2.14 43.06,62.48 R10.2
  Bottom 0.406: v39.62,45.72 38.1,45.72 37.08,46.74 37.08,60.71 IC2.14 44.2,67.82 44.2,78.23 v49.78,83.82
PLANT_IN
  Top 0.406: PLANT_IN.2 61.65,99.57 69.6,99.57 70.61,98.55 70.61,74.24 71.63,73.23 73.08,73.23 82.88,63.42 82.88,50.37 73.15,40.64 R13.2
PLANT_OUT  (via drill 0.35)
  Top 0.406: IC4.1 54.79,35.74 54.79,20.9 59.94,15.75 69.34,15.75 71.69,13.4 | PLANT_OUT.1 v67.56,88.9 | v72.64,88.9 73.82,87.72 73.82,73.31 84.33,62.8 84.33,44.95 86.94,42.33 86.94,18.55 80.77,12.38 80.77,10.67 78.74,8.64 71.63,8.64 70.61,9.65 70.61,12.32 71.69,13.4 | R28.1 72.96,13.4 71.69,13.4
  Bottom 0.406: v67.56,88.9 v72.64,88.9
POT
  Top 0.406: J4.1 9.14,92.96 R1.S
PWM  (via drill 0.35)
  Top 0.406: v35.05,41.15 35.05,39.62 35.56,39.12 35.56,28.19 31.75,24.38 IC3.7
  Bottom 0.406: v35.05,41.15 35.05,61.85 42.82,69.62 42.82,80.92 53.85,91.95 53.85,95.68 | 53.85,95.68 55.7,97.54 PLANT_IN.1 | PWM.1 PWM.2 53.85,95.68
RAMP  (via drill 0.35)
  Top 0.406: v34.04,41.15 34.04,39.12 34.54,38.61 34.54,29.72 31.75,26.92 IC3.6 28.96,24.64 28.96,18.54 T1.C 36.07,11.43 | 36.07,11.43 36.07,6.35 | C10.2 37.85,4.57 36.07,6.35 | Q1.3 36.83,11.43 36.07,11.43 | C9.2 35.69,6.35 36.07,6.35
  Bottom 0.406: v34.04,41.15 34.29,41.41 34.29,61.91 42.24,69.86 42.24,86.61 48.59,92.96 RAMP.1 RAMP.2
SET  (via drill 0.35)
  Top 0.406: IC2.3 30.99,57.4 v27.94,60.45 | v22.35,68.07 21.84,68.58 J4.6 J4.4 J4.2 21.84,96.01 21.84,96.52 21.84,97.21 SET.2 SET.1
  Bottom 0.406: v27.94,60.45 27.94,65.02 24.89,68.07 v22.35,68.07
STEP
  Top 0.406: J4.5 17.27,85.85 17.27,67.56 15.75,66.04 | 15.75,66.04 8.89,66.04 S1.3 | R2.1 17.4,61.73 R3.2 17.27,64.52 15.75,66.04
VCC
  pour Top: 0,0 88.9,0 88.9,101.6 0,101.6
VSS  (via drill 0.35)
  Top 0.406: R30.2 v29.46,9.14 | C9.1 v33.53,9.14 | C2.2 v12.7,8.13 | C5.2 v82.8,45.72 | C7.2 v82.8,31.5 | C11.1 v43.69,21.84 | R37.1 v53.34,32 | R3.1 v17.27,57.4 | R4.1 v13.21,57.4 | R11.1 v14.73,14.73
  Top 0.813: S2.6 9.18,21.05 v9.14,21.08
  pour Bottom: 7.11,101.6 88.9,101.6 88.9,0 0,0 0,33.02 67.56,33.02 67.56,54.36 7.11,54.36

### Text on the board
tPlace: PWM PLANT / INPUT | POT / FNC / STEP | OUT PLANT / OUT | 1 | 1 | 1 | larger | larger | larger | 0.1 | 10 | 0.1 | 10 | 0.1 | 10 | Chris Coulston / Spring 2026 / Analog PID controller / Rev 8.0 | 0 | ∞ | 0 | ∞ | 0 | ∞ | 1 | larger | 10 | 0.1 | 0 | ∞ | PLANT / GAIN | +9V | ON | OFF | -9V | Board # | Butter / 100Hz corner